# Altium project DroneV1.PrjPcb
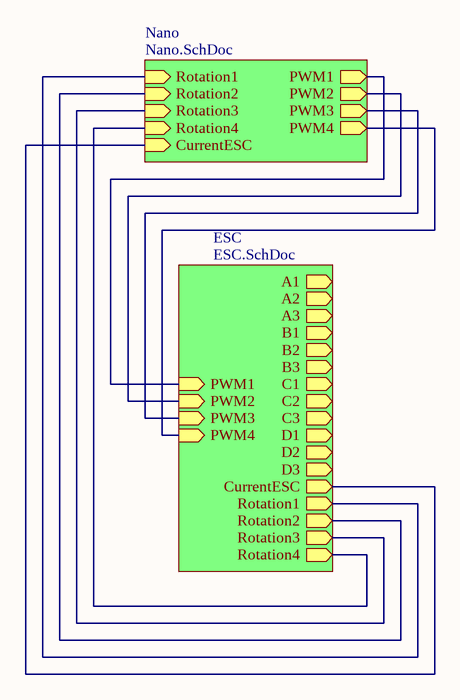
[diagram p0: Main.SchDoc]
5 sheets, 90 parts. Net scope: hierarchical (ports join the sheet entries above them; power ports are global).
Board file: Main.PcbDoc
Sheets:
  Main.SchDoc
    ESC = ESC.SchDoc
      A_MosfetField = MosfetField.SchDoc
      B_MosfetField = MosfetField.SchDoc
      C_MosfetField = MosfetField.SchDoc
      C_MosfetField = MosfetField.SchDoc
      U_Control = Control.SchDoc
    Nano = Nano.SchDoc

## Sheet Main.SchDoc: Main
size A; Revision: REV1; SheetNumber: 1; SheetTotal: 4

### Sub-sheets
ESC = ESC.SchDoc: Rotation1 (out), Rotation4 (out), CurrentESC (out), D2 (out), D3 (out), Rotation3 (out), Rotation2 (out), C1 (out), D1 (out), A3 (out), B3 (out), A2 (out), B2 (out), C2 (out), C3 (out), B1 (out), A1 (out), PWM3 (in), PWM2 (in), PWM4 (in), PWM1 (in)
Nano = Nano.SchDoc: Rotation2 (in), PWM4 (out), PWM2 (out), CurrentESC (in), Rotation4 (in), Rotation1 (in), PWM1 (out), PWM3 (out), Rotation3 (in)

### Nets
D4: sheet ESC/PWM1, sheet Nano/PWM1
D5~: sheet ESC/PWM2, sheet Nano/PWM2
D6~: sheet ESC/PWM3, sheet Nano/PWM3
D7: sheet ESC/PWM4, sheet Nano/PWM4
(unnamed): sheet ESC/Rotation1, sheet Nano/Rotation1
(unnamed): sheet ESC/Rotation4, sheet Nano/Rotation4
(unnamed): sheet ESC/CurrentESC, sheet Nano/CurrentESC
(unnamed): sheet ESC/Rotation3, sheet Nano/Rotation3
(unnamed): sheet ESC/Rotation2, sheet Nano/Rotation2

## Sheet ESC.SchDoc: ESC
size A; Revision: REV1; SheetNumber: 3; SheetTotal: 5
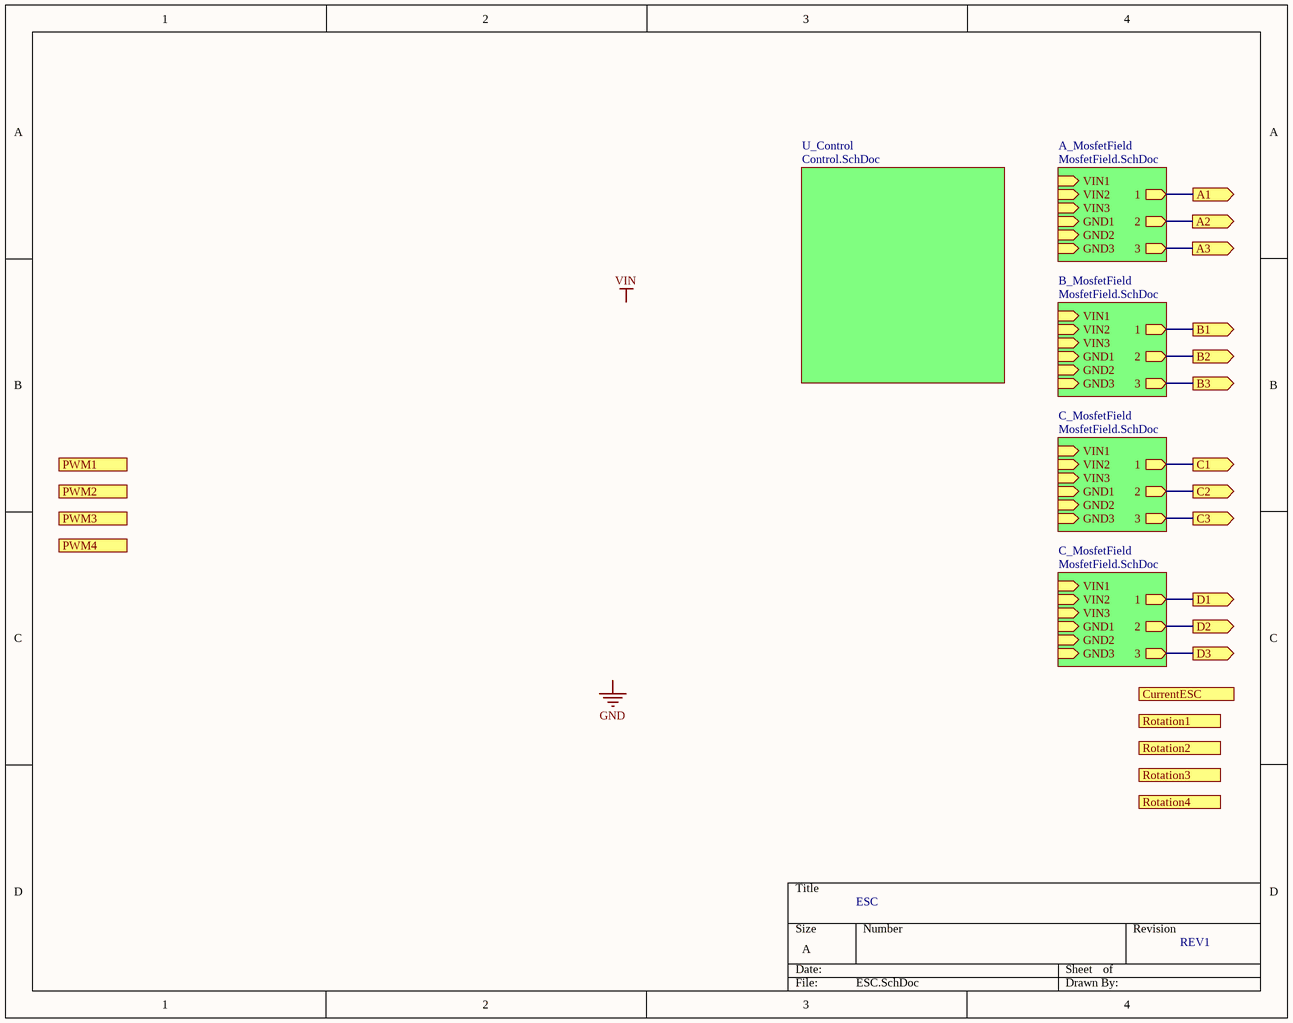
[diagram p1: ESC.SchDoc]

### Sub-sheets
A_MosfetField = MosfetField.SchDoc: VIN1 (in), GND1 (in), GND2 (in), GND3 (in), 1 (out), 3 (out), 2 (out), VIN3 (in), VIN2 (in)
B_MosfetField = MosfetField.SchDoc: VIN1 (in), GND1 (in), GND2 (in), GND3 (in), 1 (out), 3 (out), 2 (out), VIN3 (in), VIN2 (in)
C_MosfetField = MosfetField.SchDoc: VIN1 (in), GND1 (in), GND2 (in), GND3 (in), 1 (out), 3 (out), 2 (out), VIN3 (in), VIN2 (in)
C_MosfetField = MosfetField.SchDoc: VIN1 (in), GND1 (in), GND2 (in), GND3 (in), 1 (out), 3 (out), 2 (out), VIN3 (in), VIN2 (in)
U_Control = Control.SchDoc: no entries

### Ports
A1 (out), A2 (out), A3 (out), B1 (out), B2 (out), B3 (out), C1 (out), C2 (out), C3 (out), CurrentESC (out), D1 (out), D2 (out), D3 (out), PWM1 (in), PWM2 (in), PWM3 (in), PWM4 (in), Rotation1 (out), Rotation2 (out), Rotation3 (out), Rotation4 (out)

### Nets
NetU1_A_MosfetField_1: port A1, sheet A_MosfetField/1
NetU1_B_MosfetField_1: port B1, sheet B_MosfetField/1
NetU1_ESC_C_MosfetField#1_1: port C1, sheet C_MosfetField/1
NetU1_ESC_C_MosfetField#2_1: port D1, sheet C_MosfetField/1
NetU2_A_MosfetField_1: port A2, sheet A_MosfetField/2
NetU2_B_MosfetField_1: port B2, sheet B_MosfetField/2
NetU2_ESC_C_MosfetField#1_1: port C2, sheet C_MosfetField/2
NetU2_ESC_C_MosfetField#2_1: port D2, sheet C_MosfetField/2
NetU3_A_MosfetField_1: port A3, sheet A_MosfetField/3
NetU3_B_MosfetField_1: port B3, sheet B_MosfetField/3
NetU3_ESC_C_MosfetField#1_1: port C3, sheet C_MosfetField/3
NetU3_ESC_C_MosfetField#2_1: port D3, sheet C_MosfetField/3

### Notes on the sheet
- Labels drawn without touching a wire or pin: GND, VIN

## Sheet MosfetField.SchDoc: MosfetField
size A; Revision: REV1; SheetNumber: 4; SheetTotal: 4
Used 4 times, as channels ESC/A_MosfetField, ESC/B_MosfetField, ESC/C_MosfetField, ESC/C_MosfetField. Parts and nets are listed once, with the designators drawn on the sheet.
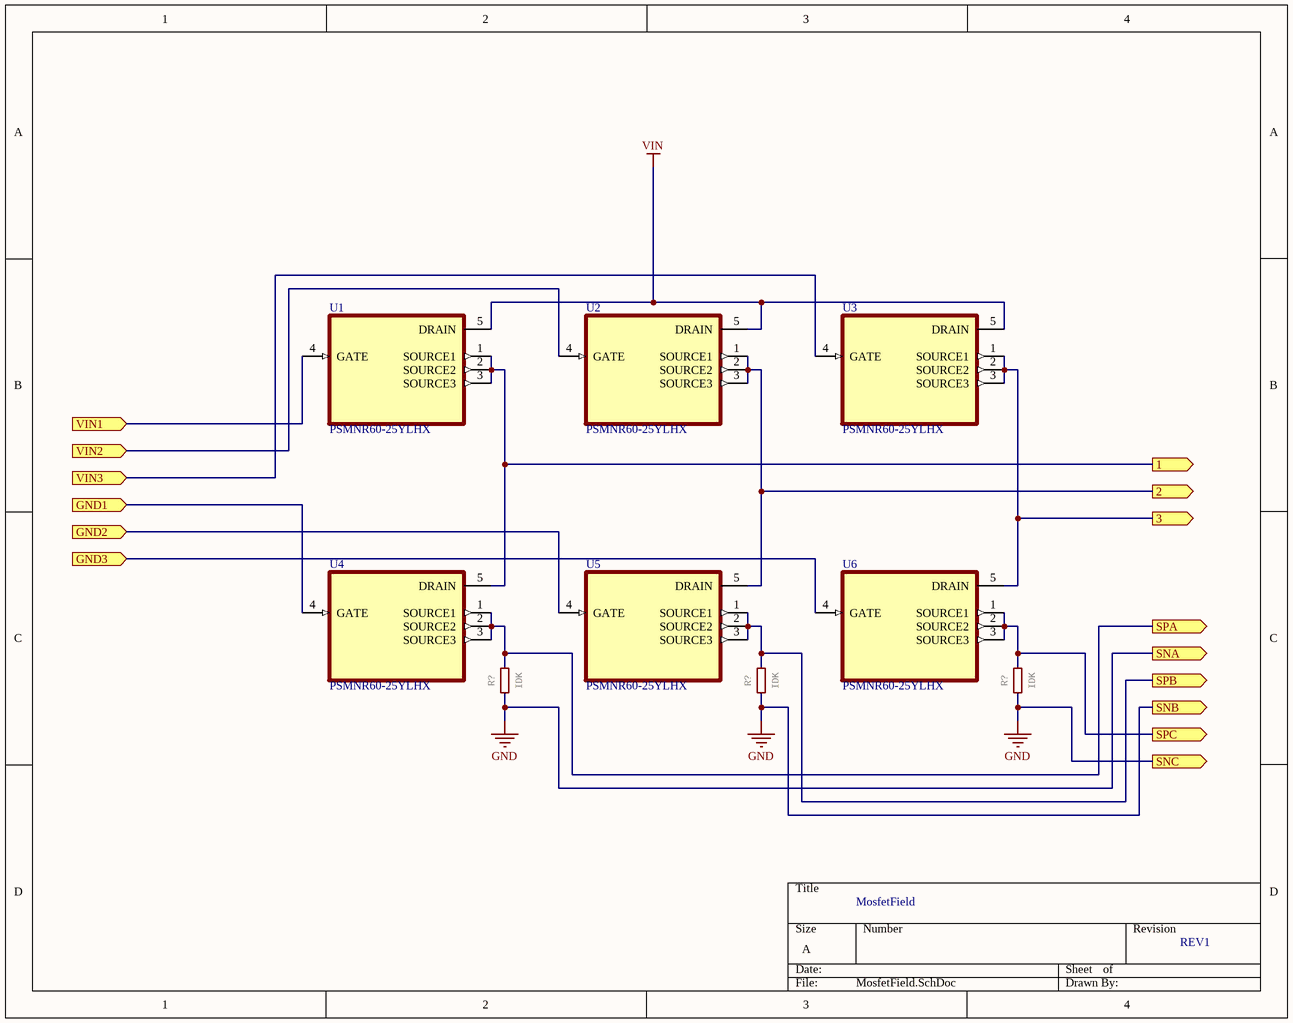
[diagram p2: MosfetField.SchDoc]

### Parts
(Parts that share a designator on the sheet are numbered #1, #2 ... from top to bottom, then left to right.)
R?#1  IDK  [0402-1005X55N]
R?#2  IDK  [0402-1005X55N]
R?#3  IDK  [0402-1005X55N]
U1  PSMNR60-25YLHX  [TO127P600X120-5N]
U2  PSMNR60-25YLHX  [TO127P600X120-5N]
U3  PSMNR60-25YLHX  [TO127P600X120-5N]
U4  PSMNR60-25YLHX  [TO127P600X120-5N]
U5  PSMNR60-25YLHX  [TO127P600X120-5N]
U6  PSMNR60-25YLHX  [TO127P600X120-5N]

### Ports
1 (out), 2 (out), 3 (out), GND1 (in), GND2 (in), GND3 (in), SNA (out), SNB (out), SNC (out), SPA (out), SPB (out), SPC (out), VIN1 (in), VIN2 (in), VIN3 (in)

### Nets
GND: R?#1.1 R?#2.1 R?#3.1 ; port SNA, port SNB, port SNC
VIN: U1.5(DRAIN) U2.5(DRAIN) U3.5(DRAIN)
1: U1.1(SOURCE1) U1.2(SOURCE2) U1.3(SOURCE3) U4.5(DRAIN) ; port 1
2: U2.1(SOURCE1) U2.2(SOURCE2) U2.3(SOURCE3) U5.5(DRAIN) ; port 2
3: U3.1(SOURCE1) U3.2(SOURCE2) U3.3(SOURCE3) U6.5(DRAIN) ; port 3
GND1: U4.4(GATE) ; port GND1
GND2: U5.4(GATE) ; port GND2
GND3: U6.4(GATE) ; port GND3
SPA: R?#1.2 U4.1(SOURCE1) U4.2(SOURCE2) U4.3(SOURCE3) ; port SPA
SPB: R?#2.2 U5.1(SOURCE1) U5.2(SOURCE2) U5.3(SOURCE3) ; port SPB
SPC: R?#3.2 U6.1(SOURCE1) U6.2(SOURCE2) U6.3(SOURCE3) ; port SPC
VIN1: U1.4(GATE) ; port VIN1
VIN2: U2.4(GATE) ; port VIN2
VIN3: U3.4(GATE) ; port VIN3

### Channels
ESC/A_MosfetField: designators R?=R?_A_MosfetField#3 R?=R?_A_MosfetField#2 R?=R?_A_MosfetField#1 U1=U1_A_MosfetField U2=U2_A_MosfetField U3=U3_A_MosfetField U4=U4_A_MosfetField U5=U5_A_MosfetField U6=U6_A_MosfetField; ports 1=NetU1_A_MosfetField_1 2=NetU2_A_MosfetField_1 3=NetU3_A_MosfetField_1 GND1=NetU4_A_MosfetField_4 GND2=NetU5_A_MosfetField_4 GND3=NetU6_A_MosfetField_4 SNA=GND SNB=GND SNC=GND SPA=NetR?_A_MosfetField#1_2 SPB=NetR?_A_MosfetField#2_2 SPC=NetR?_A_MosfetField#3_2 VIN1=NetU1_A_MosfetField_4 VIN2=NetU2_A_MosfetField_4 VIN3=NetU3_A_MosfetField_4
ESC/B_MosfetField: designators R?=R?_B_MosfetField#3 R?=R?_B_MosfetField#2 R?=R?_B_MosfetField#1 U1=U1_B_MosfetField U2=U2_B_MosfetField U3=U3_B_MosfetField U4=U4_B_MosfetField U5=U5_B_MosfetField U6=U6_B_MosfetField; ports 1=NetU1_B_MosfetField_1 2=NetU2_B_MosfetField_1 3=NetU3_B_MosfetField_1 GND1=NetU4_B_MosfetField_4 GND2=NetU5_B_MosfetField_4 GND3=NetU6_B_MosfetField_4 SNA=GND SNB=GND SNC=GND SPA=NetR?_B_MosfetField#1_2 SPB=NetR?_B_MosfetField#2_2 SPC=NetR?_B_MosfetField#3_2 VIN1=NetU1_B_MosfetField_4 VIN2=NetU2_B_MosfetField_4 VIN3=NetU3_B_MosfetField_4
ESC/C_MosfetField: designators R?=R?_ESC_C_MosfetField#3 R?=R?_ESC_C_MosfetField#2 R?=R?_ESC_C_MosfetField#1 U1=U1_ESC_C_MosfetField#1 U2=U2_ESC_C_MosfetField#1 U3=U3_ESC_C_MosfetField#1 U4=U4_ESC_C_MosfetField#1 U5=U5_ESC_C_MosfetField#1 U6=U6_ESC_C_MosfetField#1; ports 1=NetU1_ESC_C_MosfetField#1_1 2=NetU2_ESC_C_MosfetField#1_1 3=NetU3_ESC_C_MosfetField#1_1 GND1=NetU4_ESC_C_MosfetField#1_4 GND2=NetU5_ESC_C_MosfetField#1_4 GND3=NetU6_ESC_C_MosfetField#1_4 SNA=GND SNB=GND SNC=GND SPA=NetR?_ESC_C_MosfetField#1_2 SPB=NetR?_ESC_C_MosfetField#2_2 SPC=NetR?_ESC_C_MosfetField#3_2 VIN1=NetU1_ESC_C_MosfetField#1_4 VIN2=NetU2_ESC_C_MosfetField#1_4 VIN3=NetU3_ESC_C_MosfetField#1_4
ESC/C_MosfetField: designators R?=R?_ESC_C_MosfetField#6 R?=R?_ESC_C_MosfetField#5 R?=R?_ESC_C_MosfetField#4 U1=U1_ESC_C_MosfetField#2 U2=U2_ESC_C_MosfetField#2 U3=U3_ESC_C_MosfetField#2 U4=U4_ESC_C_MosfetField#2 U5=U5_ESC_C_MosfetField#2 U6=U6_ESC_C_MosfetField#2; ports 1=NetU1_ESC_C_MosfetField#2_1 2=NetU2_ESC_C_MosfetField#2_1 3=NetU3_ESC_C_MosfetField#2_1 GND1=NetU4_ESC_C_MosfetField#2_4 GND2=NetU5_ESC_C_MosfetField#2_4 GND3=NetU6_ESC_C_MosfetField#2_4 SNA=GND SNB=GND SNC=GND SPA=NetR?_ESC_C_MosfetField#4_2 SPB=NetR?_ESC_C_MosfetField#5_2 SPC=NetR?_ESC_C_MosfetField#6_2 VIN1=NetU1_ESC_C_MosfetField#2_4 VIN2=NetU2_ESC_C_MosfetField#2_4 VIN3=NetU3_ESC_C_MosfetField#2_4

### Library data of the parts
R?#1-R?#3 = R-0402: SMD Resistor; MANUFACTURER: Yageo; MANUFACTURER-PN: RC0402FR-07330RL; GateName_1: G$1; SymbolName_1: R; DeviceName: -0402; CODE-ARDUINO: 2229; NOTE: NO; LibraryName: Arduino-rcl; DeviceSetName: R; DATASHEET: www.yageo.com.tw/exep/pages/download/literatures/PYu-R_INT-thick_7.pdf; DISTRIBUTOR-LINK: http://www.digikey.com/product-detail/en/yageo/RC0402FR-07330RL/311-330LRCT-ND/729541; DISTRIBUTOR-PN: 311-330LRCT-ND
U1-U6 = PSMNR60-25YLHX: N-Channel 25V 300A (Ta) 268W (Ta) Surface Mount LFPAK56, Power-SO8; MF: Nexperia; MP: PSMNR60-25YLHX; Price: None; SnapEDA_Link: https://www.snapeda.com/parts/PSMNR60-25YLHX/Nexperia/view-part/5062034/?ref=snap; Availability: Warning; Purchase-URL: https://pricing.snapeda.com/search/part/PSMNR60-25YLHX/?ref=eda; Value: *; Check_prices: https://www.snapeda.com/parts/PSMNR60-25YLHX/Nexperia/view-part/5062034/?ref=eda; Package: LFPAK56-4 Nexperia USA Inc.

## Sheet Control.SchDoc
size B; SheetNumber: 5; SheetTotal: 5

## Sheet Nano.SchDoc: NANO33BLE_V2.0
size 409 x 289 mm; SheetTotal: 4; Origin: Eagle; Date: 2021-02-16 11:48:18 AM; SheetNumber: 2; CODE-ARDUINO: DNP; DATASHEET: DNP; DISTRIBUTOR-LINK: DNP; DISTRIBUTOR-PN: DNP; MANUFACTURER: DNP; MANUFACTURER-PN: DNP; NOTE: DNP; Value: DNP; GateName_1: G$1; SymbolName_1: A3L-LOC; LibraryName: Arduino-utility; DeviceSetName: A3-FRAME; Sheet: Sheet:; ReferenceDesignsAREPROVIDED"ASIS"AND"WITHALLFAULTS.ArduinoSADISCLAIMSALLOTHERWARRANTIES,EXPRESSORIMPLIED,
REGARDINGPRODUCTS,INCLUDINGBUTNOTLIMITEDTO,ANYIMPLIEDWARRANTIESOFMERCHANTABILITYORFITNESSFORAPARTICULARPURPOSE

ArduinoSAmaymakechangestospecificationsandproductdescriptionsatanytime,withoutnotice.TheCustomermustnot
relyontheabsenceorcharacteristicsofanyfeaturesorinstructionsmarked"reserved"or"undefined."ArduinoSAreserves
theseforfuturedefinitionandshallhavenoresponsibilitywhatsoeverforconflictsorincompatibilitiesarisingfromfuturechangestothem.
TheproductinformationontheWebSiteorMaterialsissubjecttochangewithoutnotice.Donotfinalizeadesignwiththisinfo

ARDUINOandotherArduinobrandsandlogosandTrademarksofArduinoSA.AllArduinoSATrademarkscannotbeusedwithoutowner'sformalpermission: Reference Designs ARE PROVIDED "AS IS" AND "WITH ALL FAULTS. Arduino SA DISCLAIMS ALL OTHER WARRANTIES, EXPRESS OR IMPLIED, / REGARDING PRODUCTS, INCLUDING BUT NOT LIMITED TO, ANY IMPLIED WARRANTIES OF MERCHANTABILITY OR FITNESS FOR A PARTICULAR PURPOSE / Arduino SA may make changes to specifications and product descriptions at any time, without notice. The Customer must not / rely on the absence or characteristics of any features or instructions marked "reserved" or "undefined." Arduino SA reserves / these for future definition and shall have no responsibility whatsoever for conflicts or incompatibilities arising from future changes to them. / The product information on the Web Site or Materials is subject to change without notice. Do not finalize a design with this info / ARDUINO and other Arduino brands and logos and Trademarks of Arduino SA. All Arduino SA Trademarks cannot be used without owner's formal permission; ThisworkislicensedunderaCreativeCommonsAttribution-ShareAlike4.0InternationalLicense.: This work is licensed under a Creative Commons Attribution-ShareAlike 4.0 International License.
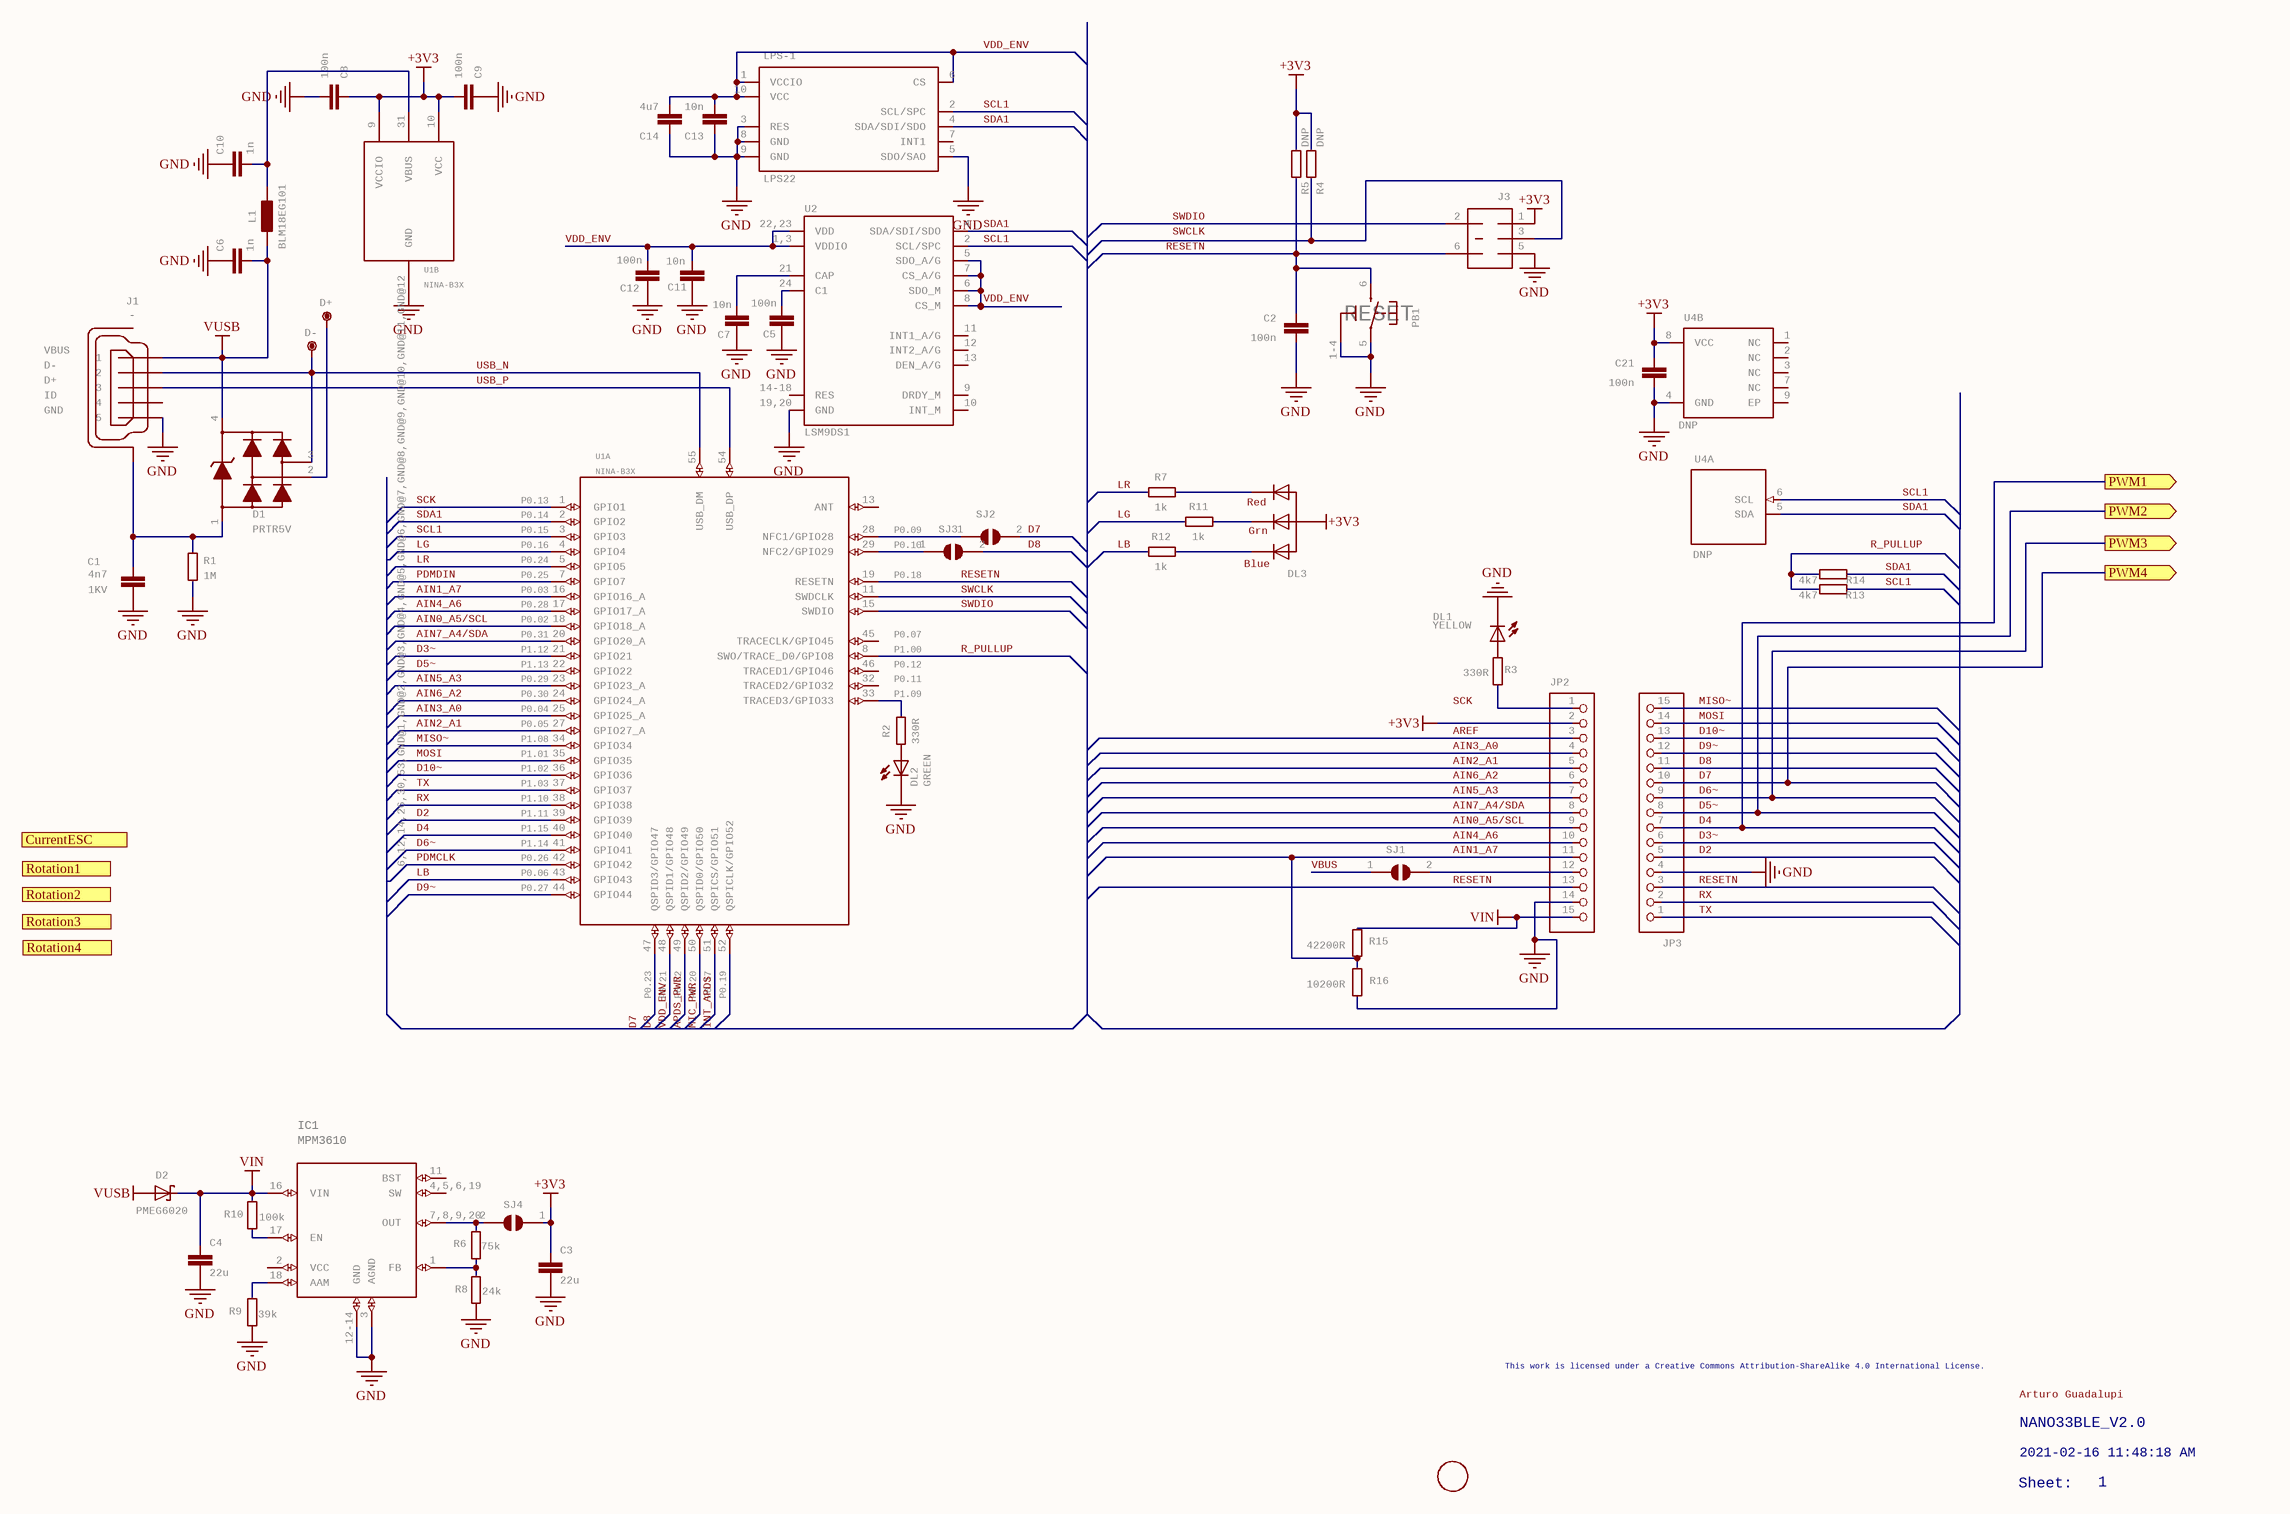
[diagram p3: Nano.SchDoc]

### Parts
C1  4n7  VOLTAGE: 1KV  [0805-R2013X50N]
C2  100n  [0402-1005X55N]
C3  22u  [0805-R2013X50N]
C4  22u  [0805-R2013X50N]
C5  100n  [0402-1005X55N]
C6  1n  [0402-1005X55N]
C7  10n  [0402-1005X55N]
C8  100n  [0402-1005X55N]
C9  100n  [0402-1005X55N]
C10  1n  [0402-1005X55N]
C11  10n  [0402-1005X55N]
C12  100n  [0402-1005X55N]
C13  10n  [0402-1005X55N]
C14  4u7  [0402-1005X55N]
C21  100n  [0402-1005X55N]
D1  PRTR5V  [SOT190P230X110-4N]
D2  PMEG6020  [SODFL3517X110N]
D+  DNP  [TP-1.00MM]  (value not drawn)
D-  DNP  [TP-1.00MM]  (value not drawn)
DL1  YELLOW  [LEDC1608X80N-AK]
DL2  GREEN  [LEDC1608X80N-AK]
DL3  -  [SMLP34RGB2W]  (value not drawn)
FD1  DNP  [FD-1-1.5]  (value not drawn)
IC1  MPM3610  [MPM3610]
J1  -  [ZX62-AB-5PA]
J3  DNP  [2X03-TP1]  (value not drawn)
JP2  PINHD-1X15-CASTELLATED  [1X15-CASTELL]  (value not drawn)
JP3  PINHD-1X15-CASTELLATED  [1X15-CASTELL]  (value not drawn)
L1  BLM18EG101  [0603-1608X90N]
LPS-1  LPS22  [LPS22H]
PB1  PTS820  [C&K_PTS820_NO_HOLES]  (value not drawn)
R1  1M  [0402-1005X55N]
R2  330R  [0402-1005X55N]
R3  330R  [0402-1005X55N]
R4  DNP  [0402-1005X55N]
R5  DNP  [0402-1005X55N]
R6  75k  [0402-1005X55N]
R7  1k  [0402-1005X55N]
R8  24k  [0402-1005X55N]
R9  39k  [0402-1005X55N]
R10  100k  [0402-1005X55N]
R11  1k  [0402-1005X55N]
R12  1k  [0402-1005X55N]
R13  4k7  [0402-1005X55N]
R14  4k7  [0402-1005X55N]
R15  42200R  [0402-1005X55N]
R16  10200R  [0402-1005X55N]
SJ1  DNP  [SJ]  (value not drawn)
SJ2  DNP  [SJ]  (value not drawn)
SJ3  DNP  [SJ]  (value not drawn)
SJ4  DNP  [SJ]  (value not drawn)
U1  NINA-B3X  [NINA-B3X]  (parts A,B of 2)
U2  LSM9DS1  [LSM9DS1_TEMP_LGA24-8X4]
U4  DNP  [SON50P300X200X60-9N-EP160X140]  (parts A,B of 2)

### Ports
CurrentESC (in), PWM1 (out), PWM2 (out), PWM3 (out), PWM4 (out), Rotation1 (in), Rotation2 (in), Rotation3 (in), Rotation4 (in)

### Nets
+3V3: C3.1 C8.1 C9.2 C21.1 DL3.1(A) J3.1 JP2.2 R4.2 R5.2 SJ4.1 U1.9(VCCIO) U1.10(VCC) U4.8(VCC)
GND: C1.2 C2.2 C3.2 C4.2 C5.1 C6.1 C7.1 C8.2 C9.1 C10.1 C11.1 C12.1 C13.1 C14.1 C21.2 DL1.C DL2.C IC1.3(AGND) IC1.12-14(GND) J1.5 J3.5 JP2.14 JP3.4 LPS-1.3(RES) LPS-1.5(SDO/SAO) LPS-1.8(GND) LPS-1.9(GND) PB1.1-4 PB1.5 R1.1 R8.1 R9.1 R16.2 U1.6,12,14,26,30,53,GND@1,GND@2,GND@3,GND@4,GND@5,GND@6,GND@7,GND@8,GND@9,GND@10,GND@11,GND@12(GND) U2.19,20(GND) U4.4(GND)
VIN: C4.1 D2.C IC1.16(VIN) JP2.15 R10.2 R15.1
VUSB: C6.2 D1.4 D2.A J1.1 L1.1
AIN0_A5/SCL: JP2.9 U1.18(GPIO18_A)
AIN1_A7: JP2.11 R15.2 R16.1 U1.16(GPIO16_A)
AIN2_A1: JP2.5 U1.27(GPIO27_A)
AIN3_A0: JP2.4 U1.25(GPIO25_A)
AIN4_A6: JP2.10 U1.17(GPIO17_A)
AIN5_A3: JP2.7 U1.23(GPIO23_A)
AIN6_A2: JP2.6 U1.24(GPIO24_A)
AIN7_A4/SDA: JP2.8 U1.20(GPIO20_A)
APDS_PWR: U1.50(QSPID0/GPIO50)
AREF: JP2.3
D2: JP3.5 U1.39(GPIO39)
D3~: JP3.6 U1.21(GPIO21)
D4: JP3.7 U1.40(GPIO40) ; port PWM1
D5~: JP3.8 U1.22(GPIO22) ; port PWM2
D6~: JP3.9 U1.41(GPIO41) ; port PWM3
D7: JP3.10 SJ2.2 U1.47(QSPID3/GPIO47) ; port PWM4
D8: JP3.11 R12.1 SJ3.2 U1.43(GPIO43) U1.48(QSPID1/GPIO48)  [also labelled LB]
D9~: JP3.12 U1.44(GPIO44)
D10~: JP3.13 U1.36(GPIO36)
INT_APDS: U1.52(QSPICLK/GPIO52)
LG: R11.1 U1.4(GPIO4)
LR: R7.1 U1.5(GPIO5)
MIC_PWR: U1.51(QSPICS/GPIO51)
MISO~: JP3.15 U1.34(GPIO34)
MOSI: JP3.14 U1.35(GPIO35)
PDMCLK: U1.42(GPIO42)
PDMDIN: U1.7(GPIO7)
R_PULLUP: U1.8(SWO/TRACE_D0/GPIO8)
RESETN: C2.1 J3.6 JP2.13 JP3.3 PB1.6 R5.1 U1.19(RESETN)
RX: JP3.2 U1.38(GPIO38)
SCK: U1.1(GPIO1)
SCL1: LPS-1.2(SCL/SPC) R13.1 U1.3(GPIO3) U2.2(SCL/SPC) U4.6(SCL)
SDA1: LPS-1.4(SDA/SDI/SDO) R14.1 U1.2(GPIO2) U2.4(SDA/SDI/SDO) U4.5(SDA)
SWCLK: U1.11(SWDCLK)
SWDIO: J3.2 U1.15(SWDIO)
TX: JP3.1 U1.37(GPIO37)
USB_N: D1.3 D-.X(P$1) J1.2 U1.55(USB_DM)
USB_P: J1.3 U1.54(USB_DP)
VBUS: SJ1.1
VDD_ENV: C11.2 C12.2 C13.2 C14.2 LPS-1.1(VCCIO) LPS-1.6(CS) LPS-1.10(VCC) U1.49(QSPID2/GPIO49) U2.1,3(VDDIO) U2.5(SDO_A/G) U2.6(SDO_M) U2.7(CS_A/G) U2.8(CS_M) U2.22,23(VDD)
NetC1_1: C1.1 D1.1 J1.6-11(SH) R1.2
NetC5_2: C5.2 U2.24(C1)
NetC7_2: C7.2 U2.21(CAP)
NetC10_2: C10.2 L1.2 U1.31(VBUS)
NetD1_2: D1.2 D+.X(P$1)
NetDL1_A: DL1.A R3.1
NetDL2_A: DL2.A R2.1
NetDL3_2: DL3.2(RED_C) R7.2
NetDL3_3: DL3.3(BLUE_C) R12.2
NetDL3_4: DL3.4(GREEN_C) R11.2
NetIC1_1: IC1.1(FB) R6.1 R8.2
NetIC1_7,8,9,20: IC1.7,8,9,20(OUT) R6.2 SJ4.2
NetIC1_17: IC1.17(EN) R10.1
NetIC1_18: IC1.18(AAM) R9.2
NetJ3_3: J3.3 R4.1
NetJP2_1: JP2.1 R3.2
NetJP2_12: JP2.12 SJ1.2
NetR2_2: R2.2 U1.33(TRACED3/GPIO33)
NetR13_2: R13.2 R14.2
NetSJ2_1: SJ2.1 U1.28(NFC1/GPIO28)
NetSJ3_1: SJ3.1 U1.29(NFC2/GPIO29)

Not connected (* = marked no-connect by the designer): IC1 2(VCC) 4,5,6,19(SW) 11(BST); J1 4; LPS-1 7(INT1); U1 13(ANT) 32(TRACED2/GPIO32) 45(TRACECLK/GPIO45) 46(TRACED1/GPIO46); U2 9(DRDY_M) 10(INT_M) 11(INT1_A/G) 12(INT2_A/G) 13(DEN_A/G) 14-18(RES); U4 1(NC) 2(NC) 3(NC) 7(NC) 9(EP)

### Buses and harness runs
bus 

### Notes on the sheet
- RESET
- This work is licensed under a Creative Commons Attribution-ShareAlike 4.0 International License.
- Arturo Guadalupi
- NANO33BLE_V2.0
- Sheet:
- 2021-02-16 11:48:18 AM
- 1
- Labels drawn without touching a wire or pin: R_PULLUP, SCK, SWCLK

### Library data of the parts
C1 = C-0805: SMD Capacitor; MANUFACTURER: Kemet; MANUFACTURER-PN: C0805C472KDRACTU; GateName_1: G$1; SymbolName_1: C; DeviceName: -0805; CODE-ARDUINO: 0689; LibraryName: Arduino-rcl; DeviceSetName: C; DATASHEET: http://www.kemet.com/Lists/ProductCatalog/Attachments/40/KEM_C1010_X7R_HV_SMD.pdf; DISTRIBUTOR-LINK: www.kemet.com/docfinder?Partnumber=C0805C472KDRACTU; DISTRIBUTOR-PN: 399-6738-1-ND; NOTE: -
C2 C5 C8 C9 C12 C21 = C-0402: SMD Capacitor; MANUFACTURER: TDK; MANUFACTURER-PN: C1005X5R1H104K050BB; GateName_1: G$1; SymbolName_1: C; DeviceName: -0402; CODE-ARDUINO: 0132; LibraryName: Arduino-rcl; DeviceSetName: C; DATASHEET: http://www.tdk.com/pdf/TDKMLCCCapRange.pdf; DISTRIBUTOR-LINK: http://www.digikey.com/product-detail/en/tdk-corporation/C1005X5R1H104K050BB/445-5942-1-ND/2443982; DISTRIBUTOR-PN: 445-5942-1-ND; NOTE: -
C3 C4 = C-0805: SMD Capacitor; MANUFACTURER: Samsung; MANUFACTURER-PN: CL21A226MQCLQNC; GateName_1: G$1; SymbolName_1: C; DeviceName: -0805; CODE-ARDUINO: 2233; LibraryName: Arduino-rcl; DeviceSetName: C; DATASHEET: https://media.digikey.com/pdf/Data%20Sheets/Samsung%20PDFs/CL21A226MQCLQNC_character.pdf; DISTRIBUTOR-LINK: https://www.digikey.com/product-detail/en/samsung-electro-mechanics-america-inc/CL21A226MQCLQNC/1276-2412-1-ND/3890498; DISTRIBUTOR-PN: 1276-2412-1-ND; NOTE: -
C6 C10 = C-0402: SMD Capacitor; MANUFACTURER: Samsung; MANUFACTURER-PN: CL05B102KB5NNNC; GateName_1: G$1; SymbolName_1: C; DeviceName: -0402; CODE-ARDUINO: 2321; LibraryName: Arduino-rcl; DeviceSetName: C; DATASHEET: http://www.samsungsem.com/kr/support/product-search/mlcc/__icsFiles/afieldfile/2016/08/18/S_CL05B102KB5NNNC.pdf; DISTRIBUTOR-LINK: http://www.digikey.com/product-detail/en/samsung-electro-mechanics-america-inc/CL05B102KB5NNNC/1276-1032-1-ND/3889118; DISTRIBUTOR-PN: 1276-1032-1-ND; NOTE: -
C7 C11 C13 = C-0402: SMD Capacitor; MANUFACTURER: Murata; MANUFACTURER-PN: GRM155R71H103KA88J; GateName_1: G$1; SymbolName_1: C; DeviceName: -0402; CODE-ARDUINO: 0165; LibraryName: Arduino-rcl; DeviceSetName: C; DATASHEET: http://search.murata.co.jp/Ceramy/image/img/A01X/partnumbering_e_01.pdf; DISTRIBUTOR-LINK: http://www.digikey.com/product-detail/en/murata-electronics-north-america/GRM155R71H103KA88J/490-6351-1-ND/3845548; DISTRIBUTOR-PN: 490-6351-1-ND; NOTE: -
C14 = C-0402: SMD Capacitor; MANUFACTURER: Murata; MANUFACTURER-PN: GRM155R60J475ME47D; GateName_1: G$1; SymbolName_1: C; DeviceName: -0402; CODE-ARDUINO: 0833; LibraryName: Arduino-rcl; DeviceSetName: C; DATASHEET: http://search.murata.co.jp/Ceramy/image/img/A01X/partnumbering_e_01.pdf; DISTRIBUTOR-LINK: http://www.digikey.com/product-detail/en/murata-electronics-north-america/GRM155R60J475ME47D/490-5915-1-ND/3719860; DISTRIBUTOR-PN: 490-5915-1-ND; NOTE: -
D1 = PRTR5V0U2X,215: USB ESD protection; MANUFACTURER: NXP; GateName_1: G$1; CODE-ARDUINO: 2209; SymbolName_1: PRTR5V0U2X; LibraryName: Arduino-diodes; DeviceSetName: PRTR5V0U2X,215; DATASHEET: http://www.nxp.com/documents/data_sheet/PRTR5V0U2X.pdf; DISTRIBUTOR-LINK: http://www.digikey.com/product-detail/en/nxp-semiconductors/PRTR5V0U2X,215/568-4140-1-ND/1589981; DISTRIBUTOR-PN: 568-4140-1-ND; MANUFACTURER-PN: PRTR5V0U2X,215
D2 = PMEG6020AELRX: 60 V, 2 A low leakage current Schottky barrier rectifier   Datasheet; MANUFACTURER: NXP; GateName_1: G$1; SymbolName_1: SCHOTTKY-2; CODE-ARDUINO: 2208 or 0025; LibraryName: Arduino-diodes; DeviceSetName: PMEG6020AELRX; DATASHEET: http://www.nxp.com/documents/data_sheet/PMEG6020AELR.pdf; DISTRIBUTOR-LINK: http://www.digikey.com/products/en?keywords=%20568-12710-1-ND; DISTRIBUTOR-PN: 568-12710-1-ND; MANUFACTURER-PN: PMEG6020AELRX
D+ D- = TPTP-1.00MM: Testpoint; GateName_1: G$1; DeviceSetName: TP; SymbolName_1: TESTPOINT; DeviceName: TP-1.00MM; LibraryName: Arduino-utility; CODE-ARDUINO: DNP; DATASHEET: DNP; DISTRIBUTOR-LINK: DNP; DISTRIBUTOR-PN: DNP; MANUFACTURER: DNP; MANUFACTURER-PN: DNP
DL1 = LED-0603: LED; MANUFACTURER: Avago; MANUFACTURER-PN: HSMY-C190; GateName_1: G$1; DeviceName: -0603; CODE-ARDUINO: 2243; SymbolName_1: LED; LibraryName: Arduino-diodes; DeviceSetName: LED; DATASHEET: http://media.digikey.com/pdf/Data%20Sheets/Avago%20PDFs/HSMz-Czzz.pdf; DISTRIBUTOR-LINK: http://www.digikey.com/product-detail/en/broadcom-limited/HSMY-C190/516-1424-1-ND/637748; DISTRIBUTOR-PN: 516-1424-1-ND
DL2 = LED-0603: LED; MANUFACTURER: Avago; MANUFACTURER-PN: HSMG-C190; GateName_1: G$1; DeviceName: -0603; CODE-ARDUINO: 2204; SymbolName_1: LED; LibraryName: Arduino-diodes; DeviceSetName: LED; DATASHEET: http://media.digikey.com/pdf/Data%20Sheets/Avago%20PDFs/HSMz-Czzz.pdf; DISTRIBUTOR-LINK: http://www.digikey.com/product-detail/en/broadcom-limited/HSMG-C190/516-1425-1-ND/637749; DISTRIBUTOR-PN: 516-1425-1-ND
DL3 = RGBLED-KA: 5050 RGB LED; MANUFACTURER-PN: SMLP34RGB2W3; GateName_1: G$1; SymbolName_1: RGBLED-KA; LibraryName: Arduino-diodes; DeviceSetName: RGBLED-KA; Red: Red; Grn: Grn; Blue: Blue; CODE-ARDUINO: CODE-ARDUINO; DATASHEET: https://www.rohm.com/datasheet/SMLP34RGB2W; DISTRIBUTOR-LINK: https://www.digikey.com/product-detail/en/rohm-semiconductor/SMLP34RGB2W3/SMLP34RGB2W3CT-ND/2921110; DISTRIBUTOR-PN: SMLP34RGB2W3CT-ND
FD1 = FIDUCIAL-1.5MM: Fiducial mount; GateName_1: G$1; SymbolName_1: ARDUINO_FIDUCIAL; DeviceName: -1.5MM; LibraryName: Arduino-utility; DeviceSetName: FIDUCIAL; CODE-ARDUINO: DNP; DATASHEET: DNP; DISTRIBUTOR-LINK: DNP; DISTRIBUTOR-PN: DNP; MANUFACTURER: DNP; MANUFACTURER-PN: DNP
IC1 = MPM3610: MPM3610 Step Down Regulator; MANUFACTURER: MPS; MANUFACTURER-PN: MPM3610AGQV-P; GateName_1: G$1; CODE-ARDUINO: 2093; RESTRICTIONS: NO; SymbolName_1: MPM3610; LibraryName: Arduino-ICs; DeviceSetName: MPM3610; DATASHEET: https://www.monolithicpower.com/pub/media/document/MPM3610_r1.01.pdf; DISTRIBUTOR-LINK: https://www.digikey.com/product-detail/en/monolithic-power-systems-inc/MPM3610AGQV-P/1589-1249-1-ND/5298336; DISTRIBUTOR-PN: 1589-1249-1-ND
J1 = USB-MICRO: USB - micro AB USB 2.0 Receptacle Connector 5 Position Surface Mount, Right Angle, Horizontal; MANUFACTURER: Hirose; MANUFACTURER-PN: ZX62-AB-5PA(31); GateName_1: G$1; CODE-ARDUINO: 2219; SymbolName_1: USB-MICRO; LibraryName: Arduino-connectors; DeviceSetName: USB-MICRO; VBUS: VBUS; D-: D-; D+: D+; ID: ID; GND: GND; DATASHEET: https://www.hirose.com/product/en/download_file/key_name/ZX/category/Catalog/doc_file_id/31704/?file_category_id=4&item_id=13&is_series=1; DISTRIBUTOR-LINK: http://www.digikey.com/product-detail/en/hirose-electric-co-ltd/ZX62-AB-5PA(31)/H125279CT-ND/5994741; DISTRIBUTOR-PN: H125279CT-ND
J3 = PINHD-2X03(NO4): PIN HEADER; GateName_1: G$1; SymbolName_1: 3X02(NO4); LibraryName: Arduino-connectors; DeviceSetName: PINHD-2X03(NO4); CODE-ARDUINO: DNP; DATASHEET: DNP; DISTRIBUTOR-LINK: DNP; DISTRIBUTOR-PN: DNP; MANUFACTURER: DNP; MANUFACTURER-PN: DNP
JP2 JP3 = PINHD-1X15-CASTELLATED: PIN HEADER; GateName_1: A; SymbolName_1: PINHD15; DeviceName: -CASTELLATED; LibraryName: Arduino-connectors; DeviceSetName: PINHD-1X15
L1 = FERRITE0603: SMD ferrite; MANUFACTURER: Murata; MANUFACTURER-PN: BLM18EG101TN1D; GateName_1: >NAME; DeviceName: 0603; SymbolName_1: FERRITE; LibraryName: Arduino-rcl; DeviceSetName: FERRITE; CODE-ARDUINO: -; DATASHEET: http://www.murata.com/en-us/products/productdata/8796747366430/ENFA0021.pdf; DISTRIBUTOR-LINK: https://www.digikey.com/product-detail/en/murata-electronics-north-america/BLM18EG101TN1D/490-5978-1-ND/3845178; DISTRIBUTOR-PN: 490-5978-1-ND; NOTE: -
LPS-1 = LPS2XH-22: MANUFACTURER: ST; MANUFACTURER-PN: LPS22HBTR; GateName_1: G$1; SymbolName_1: LPS25H; DeviceName: -22; DeviceSetName: LPS2XH; CODE-ARDUINO: A5390; LibraryName: Arduino-Sensors; DATASHEET: https://www.st.com/content/ccc/resource/technical/document/datasheet/bf/c1/4f/23/61/17/44/8a/DM00140895.pdf/files/DM00140895.pdf/jcr:content/translations/en.DM00140895.pdf; DISTRIBUTOR-LINK: https://www.digikey.com/product-detail/en/stmicroelectronics/LPS22HBTR/497-16265-1-ND/5799917; DISTRIBUTOR-PN: 497-16265-1-ND
PB1 = TACTILE1PTS820-NH: Tactile Switch SPST-NO Top Actuated Surface Mount; MANUFACTURER: C&K; MANUFACTURER-PN: PTS820 J25K SMTR LFS; GateName_1: G$1; SymbolName_1: TACTILE-3PINS; CODE-ARDUINO: 0173; DeviceName: PTS820-NH; LibraryName: Arduino-pushbuttons; DeviceSetName: TACTILE1; DATASHEET: http://www.ckswitches.com/media/1474/pts820.pdf; DISTRIBUTOR-LINK: https://www.digikey.com/product-detail/en/c-k/PTS820-J15M-SMTR-LFS/CKN10506CT-ND/4176681; DISTRIBUTOR-PN: PTS820 J25K SMTR LFS-ND
R1 = R-0402: SMD Resistor; MANUFACTURER: Yageo; MANUFACTURER-PN: RC0402JR-07330RL; GateName_1: G$1; SymbolName_1: R; DeviceName: -0402; CODE-ARDUINO: 0139; NOTE: NO; LibraryName: Arduino-rcl; DeviceSetName: R; DATASHEET: www.yageo.com.tw/exep/pages/download/literatures/PYu-R_INT-thick_7.pdf; DISTRIBUTOR-LINK: http://www.digikey.com/product-detail/en/yageo/RC0402JR-07330RL/311-330JRCT-ND/729412; DISTRIBUTOR-PN: 311-330JRCT-ND
R2 R3 R15 R16 = R-0402: as R?#1 on sheet MosfetField; LibraryName: Arduino-rcl; DeviceSetName: R; DATASHEET: www.yageo.com.tw/exep/pages/download/literatures/PYu-R_INT-thick_7.pdf; DISTRIBUTOR-LINK: http://www.digikey.com/product-detail/en/yageo/RC0402FR-07330RL/311-330LRCT-ND/729541; DISTRIBUTOR-PN: 311-330LRCT-ND
R4 R5 = R-0402: SMD Resistor; GateName_1: G$1; SymbolName_1: R; DeviceName: -0402; NOTE: NO; LibraryName: Arduino-rcl; DeviceSetName: R; CODE-ARDUINO: DNP; DATASHEET: DNP; DISTRIBUTOR-LINK: DNP; DISTRIBUTOR-PN: DNP; MANUFACTURER: DNP; MANUFACTURER-PN: DNP
R6 = R-0402: SMD Resistor; MANUFACTURER: Yageo; MANUFACTURER-PN: AC0402JR-0775KL; GateName_1: G$1; SymbolName_1: R; DeviceName: -0402; CODE-ARDUINO: A5480; NOTE: NO; LibraryName: Arduino-rcl; DeviceSetName: R; DATASHEET: www.yageo.com.tw/exep/pages/download/literatures/PYu-R_INT-thick_7.pdf; DISTRIBUTOR-LINK: https://www.digikey.com/products/en?keywords=%20AC0402JR-0775KL; DISTRIBUTOR-PN: AC0402JR-0775KL-ND
R7 R11 R12 = R-0402: SMD Resistor; MANUFACTURER: Yageo; MANUFACTURER-PN: RC0402FR-071KL; GateName_1: G$1; SymbolName_1: R; DeviceName: -0402; CODE-ARDUINO: 0140; NOTE: NO; LibraryName: Arduino-rcl; DeviceSetName: R; DATASHEET: www.yageo.com.tw/exep/pages/download/literatures/PYu-R_INT-thick_7.pdf; DISTRIBUTOR-LINK: http://www.digikey.com/product-detail/en/yageo/RC0402FR-071KL/311-1.00KLRCT-ND/729460; DISTRIBUTOR-PN: 311-1.00KLRCT-ND
R8 = R-0402: SMD Resistor; MANUFACTURER: Yageo; MANUFACTURER-PN: AC0402JR-0724KL; GateName_1: G$1; SymbolName_1: R; DeviceName: -0402; CODE-ARDUINO: A5478; NOTE: NO; LibraryName: Arduino-rcl; DeviceSetName: R; DATASHEET: http://www.yageo.com/NewPortal/yageodocoutput?fileName=/pdf/R-Chip/PYu-AC_51_RoHS_L_6.pdf; DISTRIBUTOR-LINK: https://www.digikey.com/products/en?keywords=AC0402JR-0724KL; DISTRIBUTOR-PN: AC0402JR-0724KL-ND
R9 = R-0402: SMD Resistor; MANUFACTURER: Yageo; MANUFACTURER-PN: RC0402JR-0739KL; GateName_1: G$1; SymbolName_1: R; DeviceName: -0402; CODE-ARDUINO: A5479; NOTE: NO; LibraryName: Arduino-rcl; DeviceSetName: R; DATASHEET: www.yageo.com.tw/exep/pages/download/literatures/PYu-R_INT-thick_7.pdf; DISTRIBUTOR-LINK: https://www.digikey.com/product-detail/en/yageo/RC0402JR-0739KL/311-39KJRCT-ND/729420; DISTRIBUTOR-PN: 311-39KJRCT-ND
R10 = R-0402: SMD Resistor; MANUFACTURER: Yageo; MANUFACTURER-PN: RC0402FR-07100KL; GateName_1: G$1; SymbolName_1: R; DeviceName: -0402; CODE-ARDUINO: 0134; NOTE: NO; LibraryName: Arduino-rcl; DeviceSetName: R; DATASHEET: www.yageo.com.tw/exep/pages/download/literatures/PYu-R_INT-thick_7.pdf; DISTRIBUTOR-LINK: http://www.digikey.com/product-detail/en/yageo/RC0402FR-07100KL/311-100KLRCT-ND/729473; DISTRIBUTOR-PN: 311-100KLRCT-ND
R13 R14 = R-0402: SMD Resistor; MANUFACTURER: Yageo; MANUFACTURER-PN: RC0402FR-074K7L; GateName_1: G$1; SymbolName_1: R; DeviceName: -0402; CODE-ARDUINO: 2196; NOTE: NO; LibraryName: Arduino-rcl; DeviceSetName: R; DATASHEET: www.yageo.com.tw/exep/pages/download/literatures/PYu-R_INT-thick_7.pdf; DISTRIBUTOR-LINK: http://www.digikey.com/product-detail/en/yageo/RC0402FR-074K7L/311-4.7KLRCT-ND/2827881; DISTRIBUTOR-PN: 311-4.7KLRCT-ND
SJ1-SJ4 = SJ: SMD solder JUMPER; GateName_1: 1; SymbolName_1: SJ; LibraryName: Arduino-utility; DeviceSetName: SJ; CODE-ARDUINO: DNP; DATASHEET: DNP; DISTRIBUTOR-LINK: DNP; DISTRIBUTOR-PN: DNP; MANUFACTURER: DNP; MANUFACTURER-PN: DNP
U1 = NINA-B3X: UBLOX BLE module; GateName_1: A; GateName_2: B; SymbolName_2: NINA-B3X-PS; SymbolName_1: NINA-B3X; LibraryName: Arduino-ucs&SoCs; DeviceSetName: NINA-B3X; P0.13: P0.13; P0.14: P0.14; P0.15: P0.15; P0.16: P0.16; P0.24: P0.24; P0.25: P0.25; P1.00: P1.00; P0.03: P0.03; P0.28: P0.28; P0.02: P0.02; P0.18: P0.18; P0.31: P0.31; P1.12: P1.12; P1.13: P1.13; P0.29: P0.29; P0.30: P0.30; P0.04: P0.04; P0.05: P0.05; P1.08: P1.08; P1.01: P1.01; P1.02: P1.02; P1.03: P1.03; P1.10: P1.10; P1.11: P1.11; P1.15: P1.15; P1.14: P1.14; P0.26: P0.26; P0.06: P0.06; P0.27: P0.27; P0.07: P0.07; P0.12: P0.12; P0.23: P0.23; P0.21: P0.21; P0.22: P0.22; P0.20: P0.20; P0.17: P0.17; P0.19: P0.19; P0.11: P0.11; P1.09: P1.09; P0.09: P0.09; P0.10: P0.10
U2 = LSM9DS1_TEMP_LSM9DS1: LSM9DS1 3D accelerometer, gyroscope & magnetometer    The LSM9DS1 is a system-in-package featuring a 3D digital linear acceleration sensor, a 3D digital angular rate sensor, and a 3D digital magnetic sensor.   The LSM9DS1 has a linear acceleration full scale of Â±2g/Â±4g/Â±8/Â±16 g, a magnetic field full scale of Â±4/Â±8/Â±12/Â±16 gauss and an angular rate of Â±245/Â±500/Â±2000 dps.   The LSM9DS1 includes an I2 C serial bus interface supporting standard and fast mode (100 kHz and 400 kHz) and an SPI serial standard interface.   Magnetic, accelerometer and gyroscope sensing can be enabled or set in power-down mode separately for smart power management.   The LSM9DS1 is available in a plastic land grid array package (LGA) and it is guaranteed to operate over an extended temperature range from -40 Â°C to +85 Â°C.; MANUFACTURER: ST; MANUFACTURER-PN: LSM9DS1TR; GateName_1: G$1; CODE-ARDUINO: A5430; NOTE: NO; SymbolName_1: LSM9DS1_TEMP_LSM9DS1; LibraryName: Arduino-ICs; DeviceSetName: LSM9DS1_TEMP_LSM9DS1; DATASHEET: https://www.st.com/content/ccc/resource/technical/document/datasheet/1e/3f/2a/d6/25/eb/48/46/DM00103319.pdf/files/DM00103319.pdf/jcr:content/translations/en.DM00103319.pdf; DISTRIBUTOR-LINK: https://www.digikey.com/product-detail/en/stmicroelectronics/LSM9DS1TR/497-14946-1-ND/4988079; DISTRIBUTOR-PN: 497-14946-1-ND
U4 = ATECC8-UDFN: Secure authentication and product validation device, EEPROM, I2C, 2.0 - 5.5V; GateName_1: A; SymbolName_1: ATECC508A-A; GateName_2: B; SymbolName_2: ATECC508A-B; DeviceName: 8-UDFN; DeviceSetName: ATECC; LibraryName: Arduino-ICs; CODE-ARDUINO: DNP; DATASHEET: DNP; DISTRIBUTOR-LINK: DNP; DISTRIBUTOR-PN: DNP; MANUFACTURER: DNP; MANUFACTURER-PN: DNP; NOTE: DNP

## Nets that join several sheets
GND: ESC/A_MosfetField (R?_A_MosfetField#1.1 R?_A_MosfetField#2.1 R?_A_MosfetField#3.1), ESC/B_MosfetField (R?_B_MosfetField#1.1 R?_B_MosfetField#2.1 R?_B_MosfetField#3.1), ESC/C_MosfetField (R?_ESC_C_MosfetField#1.1 R?_ESC_C_MosfetField#2.1 R?_ESC_C_MosfetField#3.1), ESC/C_MosfetField (R?_ESC_C_MosfetField#4.1 R?_ESC_C_MosfetField#5.1 R?_ESC_C_MosfetField#6.1), Nano (36 pins)
VIN: ESC/A_MosfetField (U1_A_MosfetField.5 U2_A_MosfetField.5 U3_A_MosfetField.5), ESC/B_MosfetField (U1_B_MosfetField.5 U2_B_MosfetField.5 U3_B_MosfetField.5), ESC/C_MosfetField (U1_ESC_C_MosfetField#1.5 U2_ESC_C_MosfetField#1.5 U3_ESC_C_MosfetField#1.5), ESC/C_MosfetField (U1_ESC_C_MosfetField#2.5 U2_ESC_C_MosfetField#2.5 U3_ESC_C_MosfetField#2.5), Nano (6 pins)